# EAGLE schematic HarveyBehaviorPCB_v1.2 (EAGLE 9.0.1)
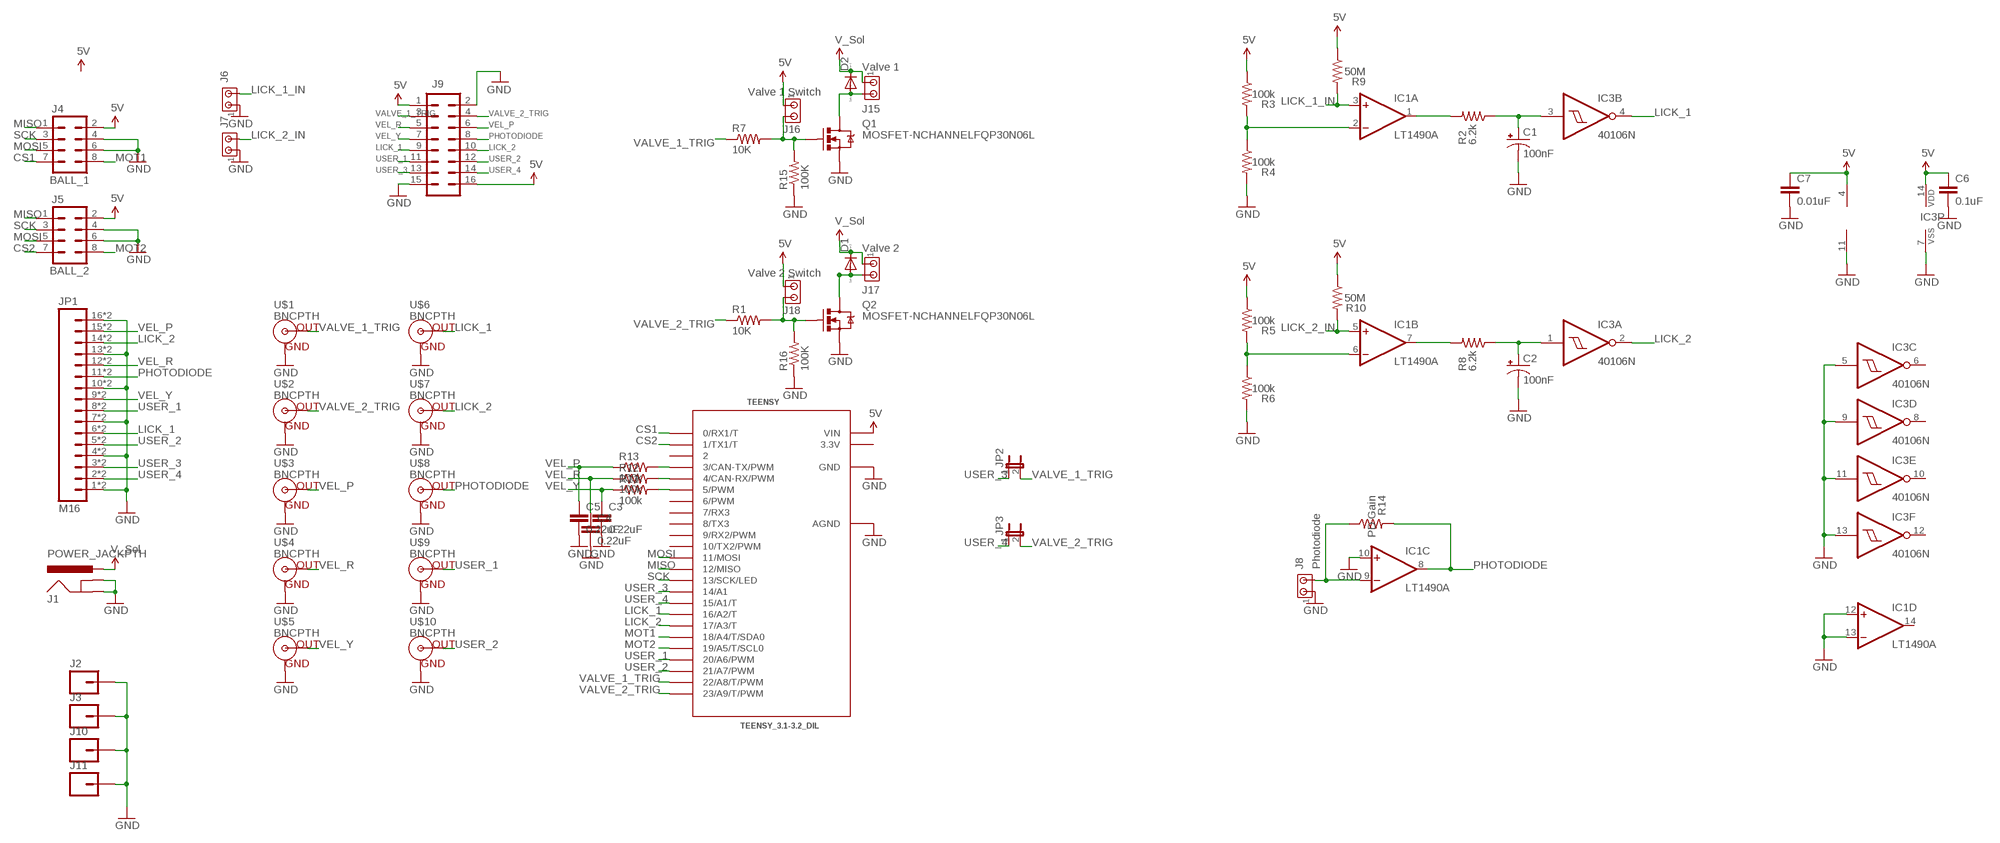
[diagram p0: schematic, sheet 1]

## Parts
C1  100nF  CAP_POLPTH2  [CPOL-RADIAL-10UF-25V]
C2  100nF  CAP_POLPTH2  [CPOL-RADIAL-10UF-25V]
C3  0.22uF  CAPPTH2  [CAP-PTH-SMALL2]
C4  0.22uF  CAPPTH2  [CAP-PTH-SMALL2]
C5  0.22uF  CAPPTH2  [CAP-PTH-SMALL2]
C6  0.1uF  0.1UF-50V-20%(PTH)KIT-EZ  [CAP-PTH-SMALL-KIT]
C7  0.01uF  0.1UF-50V-20%(PTH)KIT-EZ  [CAP-PTH-SMALL-KIT]
D1  1N4148  1N4004  [DO41-10]
D2  1N4148  1N4004  [DO41-10]
IC1  LT1490A  OPA4658P  [DIL14]
IC3  40106N  [DIL14]
J1  POWER_JACKPTH  [POWER_JACK_PTH]
J2  M01SMTSO-256-ET-0.165DIA  [SMTSO-256-ET-0.165DIA]
J3  M01SMTSO-256-ET-0.165DIA  [SMTSO-256-ET-0.165DIA]
J4  BALL_1  M04X2  [2X4]
J5  BALL_2  M04X2  [2X4]
J6  MTA02-100  [10X02MTA]
J7  MTA02-100  [10X02MTA]
J8  Photodiode  MTA02-100  [10X02MTA]
J9  M08X2  [2X8]
J10  M01SMTSO-256-ET-0.165DIA  [SMTSO-256-ET-0.165DIA]
J11  M01SMTSO-256-ET-0.165DIA  [SMTSO-256-ET-0.165DIA]
J15  Valve 1  MTA02-100  [10X02MTA]
J16  Valve 1 Switch  MTA02-100  [10X02MTA]
J17  Valve 2  MTA02-100  [10X02MTA]
J18  Valve 2 Switch  MTA02-100  [10X02MTA]
JP1  M16  [1X16_TERM_BLOCK_0.15"]
JP2  JUMPER-2PTH  [1X02]
JP3  JUMPER-2PTH  [1X02]
Q1  MOSFET-NCHANNELFQP30N06L  [TO220V]
Q2  MOSFET-NCHANNELFQP30N06L  [TO220V]
R1  10K  RESISTORPTH-1/2W  [AXIAL-0.5]
R2  6.2k  RESISTORPTH-1/2W  [AXIAL-0.5]
R3  100k  RESISTORPTH-1/2W  [AXIAL-0.5]
R4  100k  RESISTORPTH-1/2W  [AXIAL-0.5]
R5  100k  RESISTORPTH-1/2W  [AXIAL-0.5]
R6  100k  RESISTORPTH-1/2W  [AXIAL-0.5]
R7  10K  RESISTORPTH-1/2W  [AXIAL-0.5]
R8  6.2k  RESISTORPTH-1/2W  [AXIAL-0.5]
R9  50M  RESISTORPTH-1/2W  [AXIAL-0.5]
R10  50M  RESISTORPTH-1/2W  [AXIAL-0.5]
R11  100k  RESISTORPTH-1/2W  [AXIAL-0.5]
R12  100k  RESISTORPTH-1/2W  [AXIAL-0.5]
R13  100k  RESISTORPTH-1/2W  [AXIAL-0.5]
R14  PD Gain  RESISTORPTH-1/2W  [AXIAL-0.5]
R15  100K  RESISTORPTH-1/2W  [AXIAL-0.5]
R16  100K  RESISTORPTH-1/2W  [AXIAL-0.5]
TEENSY  TEENSY_3.1-3.2_DIL  [TEENSY_3.0-3.2&LC_DIL]
U$1  BNCPTH  [BNC]
U$2  BNCPTH  [BNC]
U$3  BNCPTH  [BNC]
U$4  BNCPTH  [BNC]
U$5  BNCPTH  [BNC]
U$6  BNCPTH  [BNC]
U$7  BNCPTH  [BNC]
U$8  BNCPTH  [BNC]
U$9  BNCPTH  [BNC]
U$10  BNCPTH  [BNC]

## Nets
5V: C6.1 C7.1 IC1.4(P:V+) IC3.14(P:VDD) J4.2 J5.2 J9.1 J9.16 J16.1 J18.1 R3.P$1 R5.P$1 R9.P$1 R10.P$1 TEENSY.VIN
CS1: J4.7 TEENSY.0(0/RX1/T)
CS2: J5.7 TEENSY.1(1/TX1/T)
GND: C1.2(-) C2.2(-) C3.2 C4.2 C5.2 C6.2 C7.2 IC1.10(C:+IN) IC1.11(P:V-) IC1.12(D:+IN) IC1.13(D:-IN) IC3.5(C:I) IC3.7(P:VSS) IC3.9(D:I) IC3.11(E:I) IC3.13(F:I) J1.GND J1.GNDBREAK J2.P$1 J3.P$1 J4.4 J4.6 J5.4 J5.6 J6.1 J7.1 J8.1 J9.2 J9.15 J10.P$1 J11.P$1 JP1.1 JP1.4 JP1.7 JP1.10 JP1.13 JP1.16 JP1.17 JP1.20 JP1.23 JP1.26 JP1.29 JP1.32 Q1.3(S) Q2.3(S) R4.P$2 R6.P$2 R15.P$1 R16.P$1 TEENSY.AGND TEENSY.GND U$1.GND U$2.GND U$3.GND U$4.GND U$5.GND U$6.GND U$7.GND U$8.GND U$9.GND U$10.GND
LICK_1: IC3.4(B:O) J9.9 JP1.6 JP1.22 TEENSY.16/A2(16/A2/T) U$6.S(OUT)
LICK_1_IN: IC1.3(A:+IN) J6.2 R9.P$2
LICK_2: IC3.2(A:O) J9.10 JP1.14 JP1.30 TEENSY.17/A3(17/A3/T) U$7.S(OUT)
LICK_2_IN: IC1.5(B:+IN) J7.2 R10.P$2
MISO: J4.1 J5.1 TEENSY.12(12/MISO)
MOSI: J4.5 J5.5 TEENSY.11(11/MOSI)
MOT1: J4.8 TEENSY.18/A4(18/A4/T/SDA0)
MOT2: J5.8 TEENSY.19/A5(19/A5/T/SCL0)
N$1: C1.1(+) IC3.3(B:I) R2.P$1
N$2: IC1.1(A:OUT) R2.P$2
N$3: IC1.2(A:-IN) R3.P$2 R4.P$1
N$4: D2.A J15.2 Q1.2(D)
N$5: J16.2 Q1.1(G) R7.P$2 R15.P$2
N$6: D1.A J17.2 Q2.2(D)
N$7: J18.2 Q2.1(G) R1.P$2 R16.P$2
N$8: IC1.6(B:-IN) R5.P$2 R6.P$1
N$9: C2.1(+) IC3.1(A:I) R8.P$1
N$10: IC1.7(B:OUT) R8.P$2
PHOTODIODE: IC1.8(C:OUT) J9.8 JP1.11 JP1.27 R14.P$2 U$8.S(OUT)
PHOTODIODE_IN: IC1.9(C:-IN) J8.2
SCK: J4.3 J5.3 TEENSY.13(13/SCK/LED)
USER_1: J9.11 JP1.8 JP1.24 TEENSY.20/A6(20/A6/PWM) U$9.S(OUT)
USER_2: J9.12 JP1.5 JP1.21 TEENSY.21/A7(21/A7/PWM) U$10.S(OUT)
USER_3: J9.13 JP1.3 JP1.19 JP2.1 TEENSY.14/A0(14/A1)
USER_4: J9.14 JP1.2 JP1.18 JP3.1 TEENSY.15/A1(15/A1/T)
VALVE_1_TRIG: J9.3 JP2.2 R7.P$1 TEENSY.22/A8(22/A8/T/PWM) U$1.S(OUT)
VALVE_2_TRIG: J9.4 JP3.2 R1.P$1 TEENSY.23/A9(23/A9/T/PWM) U$2.S(OUT)
VEL_P: C5.1 J9.6 JP1.15 JP1.31 R13.P$1 U$3.S(OUT)
VEL_P_PWM: R13.P$2 TEENSY.3(3/CAN-TX/PWM)
VEL_R: C4.1 J9.5 JP1.12 JP1.28 R12.P$1 U$4.S(OUT)
VEL_R_PWM: R12.P$2 TEENSY.4(4/CAN-RX/PWM)
VEL_Y: C3.1 J9.7 JP1.9 JP1.25 R11.P$1 U$5.S(OUT)
VEL_Y_PWM: R11.P$2 TEENSY.5(5/PWM)
VSOL: D1.C D2.C J1.PWR J15.1 J17.1 ; supply symbol labelled V_Sol
Unconnected: IC1.14(D:OUT) IC3.6(C:O) IC3.8(D:O) IC3.10(E:O) IC3.12(F:O) R14.P$1 TEENSY.2 TEENSY.6(6/PWM) TEENSY.7(7/RX3) TEENSY.8(8/TX3) TEENSY.9(9/RX2/PWM) TEENSY.10(10/TX2/PWM)

## Power pins joined to a net without a drawn wire
3.3V: TEENSY.3.3V

## Library data of the parts
C1 C2 = SparkFun-Capacitors:CAP_POL: Capacitor Polarized These are standard SMD and PTH capacitors. Normally 10uF, 47uF, and 100uF in electrolytic and tantalum varieties. Always verify the external diameter of the through hole cap, it varies with capacity, voltage, and manufacturer. The EIA devices should be standard.
C3-C5 = SparkFun-Capacitors:CAP: Capacitor Standard 0603 ceramic capacitor, and 0.1" leaded capacitor.
C6 C7 = SparkFun-Capacitors:0.1UF-50V-20%(PTH): CAP-08370; PROD_ID: CAP-08370
D1 D2 = diode:1N4004: DIODE general purpose rectifier, 1 A
IC1 = linear:OPA4658: Quad Wideband, Low Power Current Feedback OP AMP
IC3 = 40xx:40106: Hex SCHMITT TRIGGER
J1 = SparkFun-Connectors:POWER_JACK: Power Jack This is the standard 5.5mm barrel jack for power. The PTH is the most common, proven, reliable, footprint. The Slot footprint only works if the mill layer is transmitted to the PCB fab house so be warned. Mating wall wart : TOL-00298 (and others); PROD_ID: CONN-08197
J2 J3 J10 J11 = SparkFun-Connectors:M01: Header 1 Standard 1-pin 0.1" header. Use with straight break away headers (SKU : PRT-00116), right angle break away headers (PRT-00553), swiss pins (PRT-00743), machine pins (PRT-00117), and female headers (PRT-00115). SMTSO-256-ET is a "flush mount" nut for a 4-40 screw. The older package used to be too tight, and did not allow it to sit properly thru the drill hit. The latest (0.165DIA) fits nice and snug.
J4 J5 = SparkFun-Connectors:M04X2: .1" header, two rows of four.
J6-J8 J15-J18 = con-amp:MTA02-100: AMP connector
J9 = SparkFun-Connectors:M08X2: .1" headers, two rows of 8 each
JP1 = ofer-eagle-lib:M16: 1x16 .1" header
JP2 JP3 = SparkFun-Retired:JUMPER-2: Jumper Basic 0.1" spaced jumper. Use with breakaway headers.
Q1 Q2 = SparkFun-DiscreteSemi:MOSFET-NCHANNEL: Common NMOSFET Parts MFG P/N Store ID Prod ID FDD8780 TRANS-09984 SI7820DN TRANS-11055 FDS6630A IC-08089 2N7002PW TRANS-11151 FQP30N06L COM-10213 TRANS-10060 BSS123LT1G TRANS-08345 BSS138 TRANS-00830 BS170 2N7000; PROD_ID: TRANS-10060
R1-R16 = SparkFun-Resistors:RESISTOR: Resistor Basic schematic elements and footprints for 0603, 1206, and PTH resistors.
TEENSY = Teensy_3_and_LC_Series_Boards_v1.4:TEENSY_3.1-3.2_DIL: Teensy 3.1 or 3.2 in a DIL Layout.
U$1-U$10 = SparkFun-Connectors:BNC: BNC Connector, Mouser Part# 5227161